# Altium project CTRL.PrjPcb
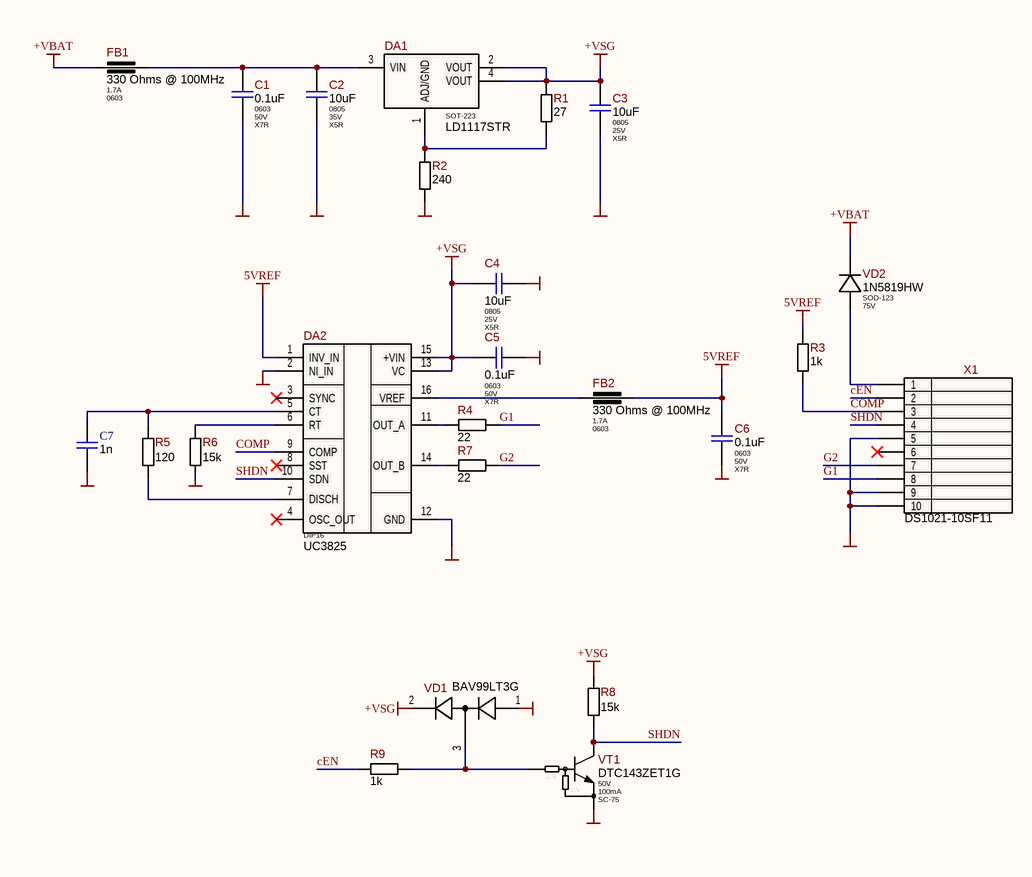
[diagram p0: CTLR.SchDoc]
__Project_Template_Version: 1.0.2; _PCB_Order_Thickness: 1.6 mm; _PCB_Order_Size: 30 x 23 mm; _PCB_Order_SilkColor: No; _PCB_Order_Silk: No; _PCB_Order_ProductionTime: 2 weeks; _PCB_Order_MinHole: 0.3 mm; _PCB_Order_Material: FR-4; _PCB_Order_MaskColor: Green / Yellow; _PCB_Order_Mask: on both sides; _PCB_Order_LayersCnt: 2; _PCB_Order_Finish: HASL; _PCB_Order_ElectricTest: Necessarily for 100% samples; _PCB_Order_Cooper: 1oz / 35um; _PCB_Order_BoardOutlineLayer: Mechanical1 (GM1); _PCB_Order_Accuracy: 0.2mm / 8mil; _Amount_Boards_Per_Stand: 1; Project_Version: 1; Project_ID: 621; Product_Name: DEV.Tnn.BRD; Authors: Vitech
1 sheet, 24 parts. Net scope: global (net labels, ports and power ports of the same name join across sheets).
Board file: CTRL.PcbDoc

## Sheet CTLR.SchDoc: =DocumentName
size A4; Author: Vitech; CompanyName: "AS Manufacturing" LLC; Organization: "AS Manufacturing" LLC; Address1: 5 Sklyarenka St.; Address2: Kyiv 04073; Address3: Ukraine; Address4: https://ajax.systems/en/; Revision: v1; SheetNumber: 1; SheetTotal: 1; Product name: DEV.Tnn.BRD; Internal reference: 621; Head: DEV.Tnn.BRD.621.v1; PCB_Designator: DEV.Tnn.BRD.621.v1; Template_version: 1.0.1

### Parts
C1  Package: 0603  Voltage: 50V  Dielectric Type: X7R  [C_CERAMIC_0603_MED]  (hidden comment: 0.1uF)
C2  Package: 0805  Voltage: 35V  Dielectric Type: X5R  [CAP-0805(2012)X125T20]  (hidden comment: 10uF)
C3  Package: 0805  Voltage: 25V  Dielectric Type: X5R  [CAP-0805(2012)X85T10]  (hidden comment: 10uF)
C4  Package: 0805  Voltage: 25V  Dielectric Type: X5R  [CAP-0805(2012)X85T10]  (hidden comment: 10uF)
C5  Package: 0603  Voltage: 50V  Dielectric Type: X7R  [C_CERAMIC_0603_MED]  (hidden comment: 0.1uF)
C6  Package: 0603  Voltage: 50V  Dielectric Type: X7R  [C_CERAMIC_0603_MED]  (hidden comment: 0.1uF)
C7  1n  [CAP: MKS2 (W=2.50MM)]
DA1  LD1117STR  [SOT-223]
DA2  Package: DIP16  Part Number: UC3825  [SOIC-16]  (hidden comment: UC3525)
FB1  value 330 Ohms @ 100MHz  Current: 1.7A  Package: 0603  [BLM18-Series_H80T15]  (hidden comment: BLM18KG331SH1D)
FB2  value 330 Ohms @ 100MHz  Current: 1.7A  Package: 0603  [BLM18-Series_H80T15]  (hidden comment: BLM18KG331SH1D)
R1  27  [R_ANY_CHIP_0805_MED]
R2  240  [R_ANY_CHIP_0805_MED]
R3  1k  [R_ANY_CHIP_0805_MED]
R4  22  [R_ANY_CHIP_0805_MED]
R5  120  [R_ANY_CHIP_0805_MED]
R6  15k  [R_ANY_CHIP_0805_MED]
R7  22  [R_ANY_CHIP_0805_MED]
R8  15k  [R_ANY_CHIP_0805_MED]
R9  1k  [R_ANY_CHIP_0805_MED]
VD1  BAV99LT3G  [SOT-23_MED]
VD2  Package: SOD-123  Voltage: 75V  [SOD-123_MED]  (hidden comment: 1N5819HW)
VT1  Vce: 50V  Ic: 100mA  Package: SC-75  [SOT-416]  (hidden comment: DTC143ZET1G)
X1  PLS-10 (Part of PLS-40)  [DS1021-10S]  (value not drawn)

### Nets
5VREF: C6.2 DA2.1(INV_IN) FB2.2 R3.2
+VBAT: FB1.1 VD2.CA
+VSG: C3.1 C4.1 C5.1 DA1.2(VOUT) DA1.4(VOUT) DA2.13(VC) DA2.15(+VIN) R1.2 R8.2 VD1.2
GND: C1.2 C2.2 C3.2 C4.2 C5.2 C6.1 C7.1 DA2.2(NI_IN) DA2.12(GND) R2.1 R6.1 VD1.1 VT1.2(E) X1.5 X1.9 X1.10
cEN: R9.2 X1.2
COMP: DA2.9(COMP) R3.1 X1.3
G1: R4.2 X1.8
G2: R7.2 X1.7
SHDN: DA2.10(SDN) R8.1 VT1.3(C) X1.4
NetC1_1: C1.1 C2.1 DA1.3(VIN) FB1.2
NetC7_2: C7.2 DA2.5(CT) R5.2
NetDA1_1: DA1.1(ADJ/GND) R1.1 R2.2
NetDA2_6: DA2.6(RT) R6.2
NetDA2_7: DA2.7(DISCH) R5.1
NetDA2_11: DA2.11(OUT_A) R4.1
NetDA2_14: DA2.14(OUT_B) R7.1
NetDA2_16: DA2.16(VREF) FB2.1
NetR9_1: R9.1 VD1.3 VT1.1(B)
NetVD2_AN: VD2.AN X1.1

Not connected (* = marked no-connect by the designer): DA2 3(SYNC)* 4(OSC_OUT)* 8(SST)*; X1 6*

### Notes on the sheet
- Title
- Product:
- Project:
- Size:
- Date:
- Variant:
- A4
- Authors:
- Time:
- Sheet
- of
- Revision:
- Commit:
- (in symbol DTC143ZET1G) 4.7k; 47k

### Library data of the parts
C1 C5 C6 = CL10B104KB8NNNC: 100nF 50V X7R ±10% 0603 Ceramic Capacitor RoHS; Manufacturer: Samsung Electro-Mechanics; Ajax_1C_ID: 15653; Ajax_1C_PN: 100nF 50V X7R 10% 0603 CL10B104KB8NNNC ceramic capacitor SMD; Ajax_1С_Status: Mass Production; Standard Lead Time: 18 Weeks; Component Status: Released; Replacement: CL10B104KB8NNND; GUID_1C: 28d36f8f-5d05-11e9-ab4e-0050569f2651; Value: 0.1uF; Part Number: CL10B104KB8NNNC; Part Type: Ceramic / X7R / 0603; Component Type: SMD; Temperature Range: -55°C ~ 125°C; Tolerance: ±10%; ComponentLink1URL: https://media.digikey.com/pdf/Data%20Sheets/Samsung%20PDFs/CL_Series_MLCC_ds.pdf; Supplier 1: Digi-Key; Supplier Part Number 1: 1276-1000-2-ND; Price: 0.00273; ComponentLink1Description: Datasheet
C2 = C2012X5R1V106K125AC: 10uF 35V X5R ±10% 0805 Low ESL Ceramic Capacitor RoHS; Manufacturer: TDK Corporation; Ajax_1C_ID: 29369; Ajax_1C_PN: 10uF 35V X5R 10% 0805 C2012X5R1V106K125AC TDK Ceramic Capacitor SMD RoHS; Ajax_1С_Status: Substitution; Standard Lead Time: 28 Weeks; Component Status: Released; Replacement: NONE; GUID_1C: b7f6aaac-a81d-11eb-ab74-0050569f2651; Value: 10uF; Part Number: C2012X5R1V106K125AC; Part Type: Ceramic / X5R / 0805; Component Type: SMD; Temperature Range: -55°C ~ 85°C; Tolerance: ±10%; ComponentLink1URL: https://product.tdk.com/system/files/dam/doc/product/capacitor/ceramic/mlcc/catalog/mlcc_commercial_general_en.pdf; Supplier 1: Digi-Key; Supplier Part Number 1: 445-14418-2-ND; Price: 0.04568564; ComponentLink1Description: Datasheet
C3 C4 = C2012X5R1E106M085AC: 10uF 25V X5R ±20% 0805 Ceramic Capacitor RoHS; Manufacturer: TDK Corporation; Ajax_1C_ID: 13798; Ajax_1C_PN: 10uF 25V X5R 20% 0805 C2012X5R1E106M085AC Ceramic Capacitor SMD RoHS; Ajax_1С_Status: Substitution; Standard Lead Time: 12 Weeks; Component Status: Released; Replacement: NONE; GUID_1C: d6f4b954-ba78-11e8-ab45-005056918265; Value: 10uF; Part Number: C2012X5R1E106M085AC; Part Type: Ceramic / X5R / 0805; Component Type: SMD; Temperature Range: -55°C ~ 85°C; Tolerance: ±20%; ComponentLink1URL: https://product.tdk.com/info/en/catalog/datasheets/mlcc_commercial_general_en.pdf; Supplier 1: Digi-Key; Supplier Part Number 1: 445-14388-1-ND; Price: 0.16; ComponentLink1Description: Datasheet
C7 = CAP_NON_POLAR_THT: Multilayer Ceramic Capacitors MLCC - SMD/SMT 10 uF 25 VDC 10% 1206 X7R; Manufacturer: Murata; Part Number: GRM31CR71E106KA12L; Voltage: *V; ComponentLink1Description: Datasheet; ComponentLink1URL: https://eu.mouser.com/datasheet/2/281/1/GRM31CR71E106KA12_01CA-1987921.pdf; Tolerance: 10 %; Component Type: THT; Package: 1206; Value: 1n
DA1 = LD1117STR: Adjustable Low Drop Positive Voltage Regulator, 1.25V to 15V, 800mA; Manufacturer: STMicroelectronics; Ajax_1C_ID: 9610; Ajax_1C_PN: LD1117STR SOT223 стабилизатор; Ajax_1С_Status: Mass Production; Standard Lead Time: 14 Weeks; Component Status: Released; Replacement: NONE; GUID_1C: cf96a4d2-0495-11e7-82cc-d8cb8a9acc66; Package: SOT-223; Part Number: LD1117STR; Part Type: Power / Linear Regulator; Component Type: SMD; Temperature Range: 0°C ~ 125°C; ComponentLink1URL: https://www.st.com/content/ccc/resource/technical/document/datasheet/99/3b/7d/91/91/51/4b/be/CD00000544.pdf/files/CD00000544.pdf/jcr:content/translations/en.CD00000544.pdf; Supplier 1: Digi-Key; Supplier Part Number 1: 497-1244-2-ND; Price: 0.11978409; ComponentLink1Description: Datasheet
DA2 = UC3525: Buck, Push-Pull Regulator Positive Output Step-Down, Step-Up/Step-Down DC-DC Controller IC 16-DIP/16-SOIC; Manufacturer: Texas; Standard Lead Time: 8 Weeks; Component Status: Released; Replacement: NONE; GUID_1C: 956a5446-e932-11eb-ab74-0050569f2651; Part Type: IC REG CTRLR BCK/PUSH-PULL; Component Type: SMD; Temperature Range: -40°C ~ 125°C; ComponentLink1URL: https://assets.nexperia.com/documents/data-sheet/74HC_HCT4051.pdf; Supplier 1: Digi-Key; Supplier Part Number 1: 1727-6049-2-ND; Price: 0.11383574; ComponentLink1Description: Datasheet
FB1 FB2 = BLM18KG331SH1D: 330 Ohms @ 100 MHz Power Line Ferrite Bead 0603, 1.7A 80mOhm; Manufacturer: Murata Electronics; Ajax_1C_ID: 31487; Ajax_1C_PN: 330R 1.7A BLM18KG331SH1D 0603 Murata Ferrite Bead; Ajax_1С_Status: RND Only; Saturation Current: NONE; Tolerance: ±25%; Component Status: Released; Standard Lead Time: 15 Weeks; GUID_1C: 8fa34a67-d98f-11eb-ab74-0050569f2651; Part Number: BLM18KG331SH1D; Part Type: Ferrite Bead; Component Type: SMD; Temperature Range: -55°C ~ 125°C; ComponentLink1URL: https://www.murata.com/en-us/products/productdata/8796737273886/QNFA9101.pdf; Supplier 1: Digi-Key; Supplier Part Number 1: 490-13257-2-ND; Replacement: NONE; Price: 0.0072; ComponentLink1Description: Datasheet
R1-R9 = RC0805JR-0722RL: 22 Ohms ±5%, 1/8W 0805 Thick Film Resistor; Manufacturer: Yageo; Ajax_1C_ID: 8822; Ajax_1C_PN: 22R 5% 0805 Resistors SMD RoHS; Ajax_1С_Status: Mass Production; Power Rating: 0.125W; Voltage: 150V; Component Status: Released; Temperature Stability: ±100ppm/°C; Replacement: NONE; GUID_1C: 3ba40fec-5951-11e6-81ec-d8cb8a9acc66; Tolerance: ±5%; Package: 0805; Part Number: RC0805JR-0722RL; Component Type: SMD; Part Type: Thick Film; Temperature Range: -55°C ~ 155°C; ComponentLink1URL: https://eu.mouser.com/datasheet/2/447/PYu_RC_Group_51_RoHS_L_10-1664068.pdf; Price: 0.0011; ComponentLink1Description: Datasheet
  R1: Value: 27
  R2: Value: 240
  R3 R9: Value: 1k
  R4 R7: Value: 22
  R5: Value: 120
  R6 R8: Value: 15k
VD1 = BAV99LT3G: Diode Array 1 Pair Series Connection, Standard, 100V, 215mA (DC), SOT-23; Manufacturer: Onsemi; Ajax_1C_ID: 73369; Ajax_1C_PN: 70V 215mA BAV99LT3G SOD-23-3 Onsemi Diode SMD RoHS; Ajax_1С_Status: RND Only; Marking: A7 M*; Component Status: Released; Standard Lead Time: 36 Weeks; Vf: 1.25V @ 150 mA; Replacement: NONE; GUID_1C: 9467e0da-0e79-11ee-a36c-005056994834; Voltage: 100V; Part Number: BAV99LT3G; Part Type: Array; Component Type: SMD; Package: SOT-23; Current: 215mA; Temperature Range: -65°C ~ 150°C; ComponentLink1URL: https://eu.mouser.com/datasheet/2/308/1/BAV99LT1_D-2310219.pdf; Supplier 1: Mouser; Supplier Part Number 1: 863-BAV99LT3G; Price: 0.04; ComponentLink1Description: Datasheet
VD2 = BAS116GWJ: Diode Standart 75V 215mA, SOD-123; Manufacturer: Nexperia USA; Ajax_1C_ID: 105914; Ajax_1C_PN: BAS116GWJ 85V 215mA Nexperia diode; Ajax_1С_Status: RND Only; Marking: GB; Component Status: On Review; Standard Lead Time: 8 Weeks; Current: 0.215A; Vf: 1.25 V @ 150 mA; Replacement: NONE; Part Number: 1N5819HW; Part Type: General; Component Type: SMD; Temperature Range: -55°C ~ 150°C; ComponentLink1URL: https://eu.mouser.com/datasheet/2/916/BAS116GW-1318917.pdf; Supplier 1: Digi-Key; Supplier Part Number 1: 1727-7322-2-ND; Price: NONE; ComponentLink1Description: Datasheet
VT1 = DTC143ZET1G: 50V, 100mA Low Vce(sat) NPN Digital Transistor, Pre-Biased 4.7k/47k (with built-in resistors); Manufacturer: Onsemi; Ajax_1C_ID: 9410; Ajax_1C_PN: DTC143ZET1G SC-75-3  биполярный NPN транзистор; Ajax_1С_Status: Mass Production; Component Status: Released; Standard Lead Time: 8 Weeks; Replacement: NONE; GUID_1C: d76ac5d5-de69-11e6-829b-d8cb8a9acc66; Part Number: DTC143ZET1G; Part Type: NPN; Component Type: SMD; Temperature Range: -55°C ~ 150 °C; ComponentLink1URL: http://www.onsemi.com/pub/Collateral/DTC143Z-D.PDF; Supplier 1: Digi-Key; Supplier Part Number 1: DTC143ZET1GOSTR-ND; Price: 0.015; ComponentLink1Description: Datasheet
X1 = DS1021-10SF11: 10 Pin 2.54mm Male Header, Vertical, 3mm and 6.1mm, PLS-5; Manufacturer: Connfly; Component Status: Released; Replacement: NONE; System: Connector; Part Number: DS1021-10SF11; Part Type: Header / Male Pin / Single Row; Component Type: PTH; Temperature Range: -40°C ~ 105°C; ComponentLink1URL: \\altiumdb.ajax.local\files\Datasheet\Connectors\DS1021.pdf; Price: 0.001875; ComponentLink1Description: Datasheet